# Altium schematic sheet Main.SchDoc
size A4; SheetNumber: 1; SheetTotal: 1
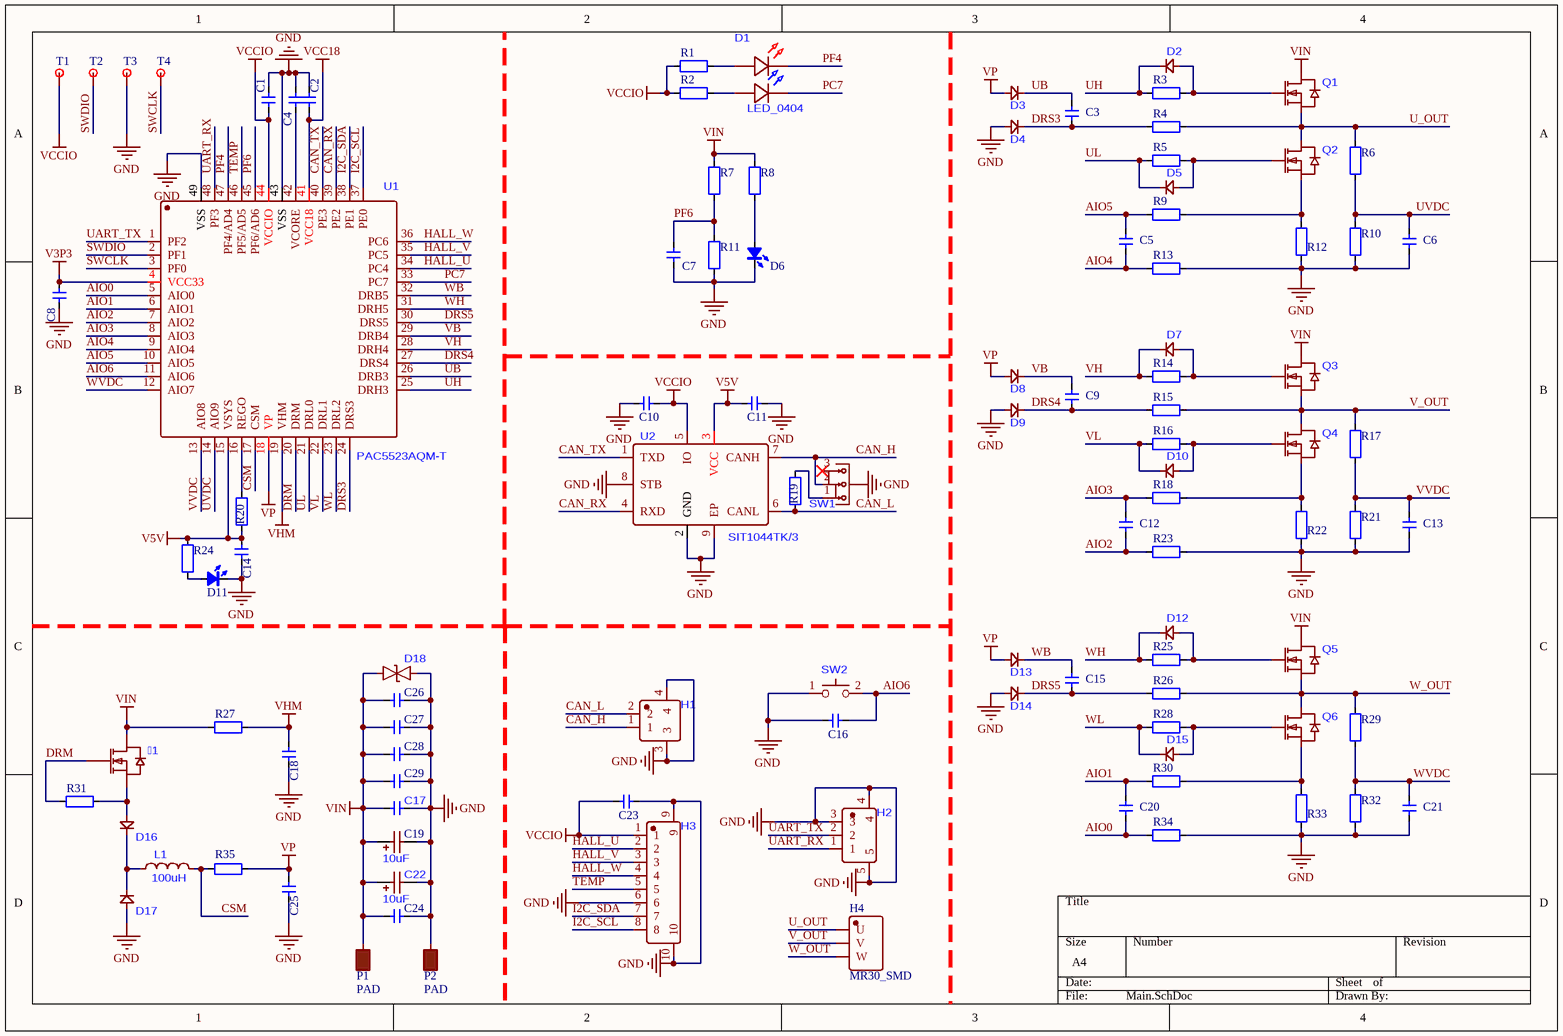
[diagram p0: Main.SchDoc]

## Parts
1  CJ2310  [SOT-23-3_L2.9-W1.3-P1.90-LS2.4-BR]  (value not drawn)
C1  4.7uF  [CAP_0402]  (value not drawn)
C2  2.2uF  [CAP_0402]  (value not drawn)
C3  1uF  [CAP_0402]  (value not drawn)
C4  2.2uF  [CAP_0402]  (value not drawn)
C5  3.3nF  [CAP_0402]  (value not drawn)
C6  100nF  [CAP_0402]  (value not drawn)
C7  10nF  [CAP_0402]  (value not drawn)
C8  2.2uF  [CAP_0402]  (value not drawn)
C9  1uF  [CAP_0402]  (value not drawn)
C10  100nF  [CAP_0402]  (value not drawn)
C11  100nF  [CAP_0402]  (value not drawn)
C12  3.3nF  [CAP_0402]  (value not drawn)
C13  100nF  [CAP_0402]  (value not drawn)
C14  4.7uF  [CAP_0402]  (value not drawn)
C15  1uF  [CAP_0402]  (value not drawn)
C16  100nF  [CAP_0402]  (value not drawn)
C17  10uF  [CAP_7343]
C18  1uF  [CAP_0402]  (value not drawn)
C19  1uF  [0603-CAP]  (value not drawn)
C20  3.3nF  [CAP_0402]  (value not drawn)
C21  100nF  [CAP_0402]  (value not drawn)
C22  10uF  [CAP_7343]
C23  100nF  [CAP_0402]  (value not drawn)
C24  1uF  [0603-CAP]  (value not drawn)
C25  10uF  [CAP_0402]  (value not drawn)
C26  电容-1206  [1206-CAP]  (value not drawn)
C27  电容-1206  [1206-CAP]  (value not drawn)
C28  电容-1206  [1206-CAP]  (value not drawn)
C29  电容-1206  [1206-CAP]  (value not drawn)
D1  LED_0404  [LED-SMD_4P-L1.0-W1.0-TL-1]
D2  1N5819W  [SOD-523_L1.2-W0.8-LS1.6-FD]  (value not drawn)
D3  1N5819W  [SOD-523_L1.2-W0.8-LS1.6-FD]  (value not drawn)
D4  1N5819W  [SOD-523_L1.2-W0.8-LS1.6-FD]  (value not drawn)
D5  1N5819W  [SOD-523_L1.2-W0.8-LS1.6-FD]  (value not drawn)
D6  LED_0402  [LED_0402]  (value not drawn)
D7  1N5819W  [SOD-523_L1.2-W0.8-LS1.6-FD]  (value not drawn)
D8  1N5819W  [SOD-523_L1.2-W0.8-LS1.6-FD]  (value not drawn)
D9  1N5819W  [SOD-523_L1.2-W0.8-LS1.6-FD]  (value not drawn)
D10  1N5819W  [SOD-523_L1.2-W0.8-LS1.6-FD]  (value not drawn)
D11  LED_0402  [LED_0402]  (value not drawn)
D12  1N5819W  [SOD-523_L1.2-W0.8-LS1.6-FD]  (value not drawn)
D13  1N5819W  [SOD-523_L1.2-W0.8-LS1.6-FD]  (value not drawn)
D14  1N5819W  [SOD-523_L1.2-W0.8-LS1.6-FD]  (value not drawn)
D15  1N5819W  [SOD-523_L1.2-W0.8-LS1.6-FD]  (value not drawn)
D16  1N5819W  [SOD-523_L1.2-W0.8-LS1.6-FD]  (value not drawn)
D17  1N5819W  [SOD-523_L1.2-W0.8-LS1.6-FD]  (value not drawn)
D18  TVS-SMB  [SMB_L4.3-W3.6-LS5.4-BI]  (value not drawn)
H1  GH1.25-2PW  [CONN-TH_2P-P1.25_XUNPU_WAFER-GH1.25-2PLB]  (value not drawn)
H2  GH1.25-3PW  [CONN-SMD_GH1.25-3P]  (value not drawn)
H3  GH1.25-8PWBPZ  [CONN-SMD_8P-P1.25_GH1.25-8PWBPZ]  (value not drawn)
H4  MR30_SMD  [MR30_SMD]
L1  100uH  [IND-SMD_L4.0-W4.0_SMNR4020]
P1  PAD  [Pad]
P2  PAD  [Pad]
Q1  WSD6036DN  [DFN3X3-8L__L3.0-W3.0-P0.65-LS3.2-BL]  (value not drawn)
Q2  WSD6036DN  [DFN3X3-8L__L3.0-W3.0-P0.65-LS3.2-BL]  (value not drawn)
Q3  WSD6036DN  [DFN3X3-8L__L3.0-W3.0-P0.65-LS3.2-BL]  (value not drawn)
Q4  WSD6036DN  [DFN3X3-8L__L3.0-W3.0-P0.65-LS3.2-BL]  (value not drawn)
Q5  WSD6036DN  [DFN3X3-8L__L3.0-W3.0-P0.65-LS3.2-BL]  (value not drawn)
Q6  WSD6036DN  [DFN3X3-8L__L3.0-W3.0-P0.65-LS3.2-BL]  (value not drawn)
R1  1K  [RES_0402]  (value not drawn)
R2  1K  [RES_0402]  (value not drawn)
R3  10R  [RES_0402]  (value not drawn)
R4  10R  [RES_0402]  (value not drawn)
R5  10R  [RES_0402]  (value not drawn)
R6  100K  [RES_0402]  (value not drawn)
R7  100K  [RES_0402]  (value not drawn)
R8  10K  [RES_0402]  (value not drawn)
R9  100R  [RES_0402]  (value not drawn)
R10  4.3K  [RES_0402]  (value not drawn)
R11  4.3K  [RES_0402]  (value not drawn)
R12  2mR  [1206-RES]  (value not drawn)
R13  100R  [RES_0402]  (value not drawn)
R14  10R  [RES_0402]  (value not drawn)
R15  10R  [RES_0402]  (value not drawn)
R16  10R  [RES_0402]  (value not drawn)
R17  100K  [RES_0402]  (value not drawn)
R18  100R  [RES_0402]  (value not drawn)
R19  120R  [RES_0402]  (value not drawn)
R20  33R  [RES_0402]  (value not drawn)
R21  4.3K  [RES_0402]  (value not drawn)
R22  2mR  [1206-RES]  (value not drawn)
R23  100R  [RES_0402]  (value not drawn)
R24  2K  [RES_0402]  (value not drawn)
R25  10R  [RES_0402]  (value not drawn)
R26  10R  [RES_0402]  (value not drawn)
R27  0R  [RES_0402]  (value not drawn)
R28  10R  [RES_0402]  (value not drawn)
R29  100K  [RES_0402]  (value not drawn)
R30  100R  [RES_0402]  (value not drawn)
R31  100R  [RES_0402]  (value not drawn)
R32  4.3K  [RES_0402]  (value not drawn)
R33  2mR  [1206-RES]  (value not drawn)
R34  100R  [RES_0402]  (value not drawn)
R35  0.33R  [RES_0402]  (value not drawn)
SW1  TA-3514-A1-B  [TA-3514-A1-B]  (value not drawn)
SW2  YD-3410  [SW-SMD_L3.9-W2.9-LS4.8-EH-A]  (value not drawn)
T1  testpoint  [testpoint]  (value not drawn)
T2  testpoint  [testpoint]  (value not drawn)
T3  testpoint  [testpoint]  (value not drawn)
T4  testpoint  [testpoint]  (value not drawn)
U1  PAC5523AQM-T  [QFN-48_L6.0-W6.0-P0.40-TL-EP4.2]
U2  SIT1044TK/3  [TDFN-8_L3.0-W3.0-P0.65-BL-EP]

## Nets
GND: C1.2 C2.2 C4.2 C6.1 C7.2 C8.1 C10.2 C11.1 C13.1 C14.1 C16.2 C17.2 C18.1 C19.1 C21.1 C22.2 C23.1 C24.1 C25.1 C26.2 C27.2 C28.2 C29.2 D4.2(A) D6.2(K) D9.2(A) D11.2(K) D14.2(A) D17.2(A) D18.2 H1.3 H1.4 H2.3 H2.4 H2.5 H3.6 H3.9 H3.10 P2.1 R10.2 R11.2 R12.1 R13.1 R21.2 R22.1 R23.1 R32.2 R33.1 R34.1 SW1.4 SW2.1 T3.1(R) U1.43(VSS) U1.49(VSS) U2.2(GND) U2.8(STB) U2.9(EP)
V3P3: C8.2 U1.4(VCC33)
V5V: C11.2 C14.2 R20.2 R24.1 U1.15(VSYS) U2.3(VCC)
VCC18: C2.1 U1.41(VCC18)
VCCIO: C1.1 C10.1 C23.2 H3.1 R1.1 R2.1 T1.1(R) U1.44(VCCIO) U2.5(IO)
VHM: C18.2 R27.1 U1.19(VHM)
VIN: 1.3(D) C17.1 C19.2 C22.1 C24.2 C26.1 C27.1 C28.1 C29.1 D18.1 P1.1 Q1.3(D) Q3.3(D) Q5.3(D) R7.1 R8.1 R27.2
VP: C25.2 D3.2(A) D8.2(A) D13.2(A) R35.1 U1.18(VP)
AIO0: C20.1 R34.2 U1.5(AIO0)
AIO1: C20.2 R30.2 U1.6(AIO1)
AIO2: C12.1 R23.2 U1.7(AIO2)
AIO3: C12.2 R18.2 U1.8(AIO3)
AIO4: C5.1 R13.2 U1.9(AIO4)
AIO5: C5.2 R9.2 U1.10(AIO5)
AIO6: C16.1 SW2.2 U1.11(AIO6)
CAN_H: H1.1 SW1.2 U2.7(CANH)
CAN_L: H1.2 R19.2 U2.6(CANL)
CAN_RX: U1.39(PE2) U2.4(RXD)
CAN_TX: U1.40(PE3) U2.1(TXD)
CSM: L1.2 R35.2 U1.17(CSM)
DRM: 1.1(G) R31.2 U1.20(DRM)
DRS3: C3.1 D4.1(C) R4.2 U1.24(DRS3)
DRS4: C9.1 D9.1(C) R15.2 U1.27(DRS4)
DRS5: C15.1 D14.1(C) R26.2 U1.30(DRS5)
HALL_U: H3.2 U1.34(PC4)
HALL_V: H3.3 U1.35(PC5)
HALL_W: H3.4 U1.36(PC6)
I2C_SCL: H3.8 U1.37(PE0)
I2C_SDA: H3.7 U1.38(PE1)
PC7: D1.3(K) U1.33(PC7)
PF4: D1.1(K) U1.47(PF4/AD4)
PF6: C7.1 R7.2 R11.1 U1.45(PF6/AD6)
SWCLK: T4.1(R) U1.3(PF0)
SWDIO: T2.1(R) U1.2(PF1)
TEMP: H3.5 U1.46(PF5/AD5)
U_OUT: H4.1(U) Q1.1(S) Q2.3(D) R4.1 R6.1
UART_RX: H2.1 U1.48(PF3)
UART_TX: H2.2 U1.1(PF2)
UB: C3.2 D3.1(C) U1.26(DRB3)
UH: D2.1(C) R3.2 U1.25(DRH3)
UL: D5.1(C) R5.2 U1.21(DRL0)
UVDC: C6.2 R6.2 R10.1 U1.14(AIO9)
V_OUT: H4.2(V) Q3.1(S) Q4.3(D) R15.1 R17.1
VB: C9.2 D8.1(C) U1.29(DRB4)
VH: D7.1(C) R14.2 U1.28(DRH4)
VL: D10.1(C) R16.2 U1.22(DRL1)
VVDC: C13.2 R17.2 R21.1 U1.13(AIO8)
W_OUT: H4.3(W) Q5.1(S) Q6.3(D) R26.1 R29.1
WB: C15.2 D13.1(C) U1.32(DRB5)
WH: D12.1(C) R25.2 U1.31(DRH5)
WL: D15.1(C) R28.2 U1.23(DRL2)
WVDC: C21.2 R29.2 R32.1 U1.12(AIO7)
Net1_2: 1.2(S) D16.2(A) R31.1
NetC4_1: C4.1 U1.42(VCORE)
NetD1_2: D1.2(A) R1.2
NetD1_4: D1.4(A) R2.2
NetD2_2: D2.2(A) Q1.2(G) R3.1
NetD5_2: D5.2(A) Q2.2(G) R5.1
NetD6_1: D6.1(A) R8.2
NetD7_2: D7.2(A) Q3.2(G) R14.1
NetD10_2: D10.2(A) Q4.2(G) R16.1
NetD11_1: D11.1(A) R24.2
NetD12_2: D12.2(A) Q5.2(G) R25.1
NetD15_2: D15.2(A) Q6.2(G) R28.1
NetD16_1: D16.1(C) D17.1(C) L1.1
NetQ2_1: Q2.1(S) R9.1 R12.2
NetQ4_1: Q4.1(S) R18.1 R22.2
NetQ6_1: Q6.1(S) R30.1 R33.2
NetR19_1: R19.1 SW1.1
NetR20_1: R20.1 U1.16(REGO)

Not connected (* = marked no-connect by the designer): SW1 3*

## Library data of the parts
1 = YJL3400A: NMOS
C1-C16 C18 C20 C21 C23 C25 = 电容-0402: Capacitor; Value: 0.1u
C17 C22 = 电容_7343
C19 C24 = 电容-0603: Capacitor; Value: 0.1u
C26-C29 = 电容-1206: Capacitor; Value: 0.1u
D1 = LED_0404: XL-1010SURUBC
D2-D5 D7-D10 D12-D17 = 1N5819W: 二极管
D6 D11 = LED_0402: LED; Type: 0402; Value: color?
D18 = TVS-SMB: TPSMB30CA-VR
L1 = 电感_4020: SMNR4020-101MT
Q1-Q6 = WSD6036DN: NMOS
R1-R11 R13-R21 R23-R32 R34 R35 = 电阻-0402: Resistor; Value: 22R
R12 R22 R33 = 电阻-1206: Resistor; Value: 22R
SW1 = TA-3514-A1-B: key
SW2 = YD-3410: 按键
T1-T4 = testpoint: 测试点
U2 = SIT1044TK/3: CAN